# Altium schematic sheet COURONNE PARTIE II SCHEMA.SchDoc
size A4
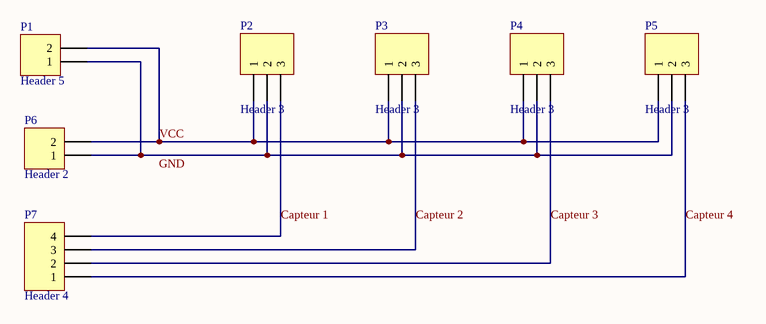
[diagram p0: COURONNE PARTIE II SCHEMA.SchDoc]

## Parts
P1  Header 5  [HDR1X2]
P2  Header 3  [HDR1X3]
P3  Header 3  [HDR1X3]
P4  Header 3  [HDR1X3]
P5  Header 3  [HDR1X3]
P6  Header 2  [HDR1X2]
P7  Header 4  [HDR1X4]

## Nets
Capteur 1: P2.3 P7.4
Capteur 2: P3.3 P7.3
Capteur 3: P4.3 P7.2
Capteur 4: P5.3 P7.1
GND: P1.1 P2.2 P3.2 P4.2 P5.2 P6.1
VCC: P1.2 P2.1 P3.1 P4.1 P5.1 P6.2

## Library data of the parts
P1 P6 = Header 2: Header, 2-Pin; LatestRevisionDate: 17-Jul-2002; LatestRevisionNote: Re-released for DXP Platform.; Publisher: Altium Limited
P2-P5 = Header 3: Header, 3-Pin; LatestRevisionDate: 17-Jul-2002; LatestRevisionNote: Re-released for DXP Platform.; Publisher: Altium Limited
P7 = Header 4: Header, 4-Pin; LatestRevisionDate: 17-Jul-2002; LatestRevisionNote: Re-released for DXP Platform.; Publisher: Altium Limited